# Altium schematic sheet FLASH.SchDoc
size A
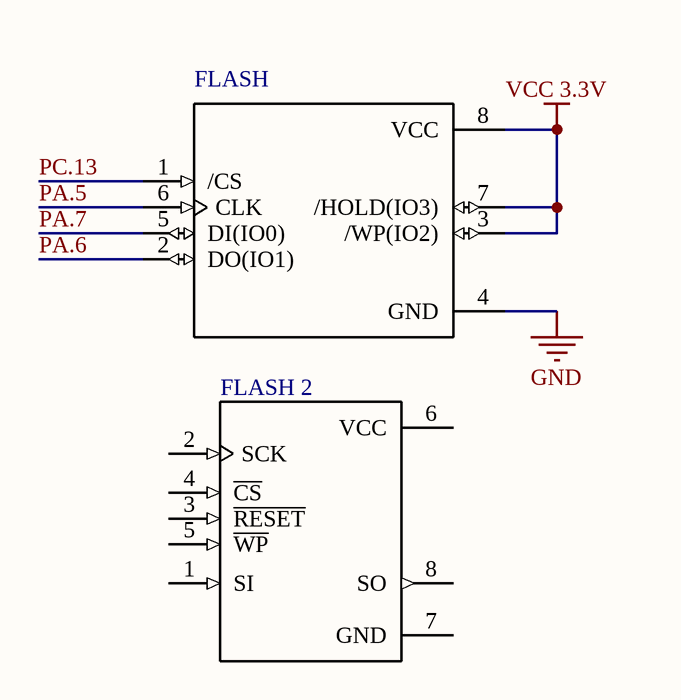
[diagram p0: FLASH.SchDoc]

## Parts
FLASH  W25Q16BVSSIG  [*SOIC127P790X216-8N]  (value not drawn)
FLASH_2  AT45DB041E-SSHNHA-T  [*SOIC127P600X175-8N]  (value not drawn)

## Nets
GND: FLASH.4(GND)
VCC 3.3V: FLASH.3(/WP(IO2)) FLASH.7(/HOLD(IO3)) FLASH.8(VCC)
PA.5: FLASH.6(CLK)
PA.6: FLASH.2(DO(IO1))
PA.7: FLASH.5(DI(IO0))
PC.13: FLASH.1(/CS)

Not connected (* = marked no-connect by the designer): FLASH_2 1(SI) 2(SCK) 3(~{RESET}) 4(~{CS}) 5(~{WP}) 6(VCC) 7(GND) 8(SO)

## Library data of the parts
FLASH = W25Q16BVSSIG: Flash, pin, soic, flash, Memory, Semiconductors and Actives, serial, ic; MF: Winbond; Price: None; Availability: Unavailable; SnapEDA_Link: https://www.snapeda.com/parts/W25Q16BVSSIG/Winbond%20Electronics/view-part/?ref=snap; MP: W25Q16BVSSIG; Package: SOIC-8 Winbond; Value: *
FLASH_2 = AT45DB041E-SSHNHA-T: Memory: Serial Flash; 4Mbit; SPI / RapidS; 85MHz; 1.65Ã·3.6V; SO8; MF: Adesto; Price: None; Availability: Unavailable; SnapEDA_Link: https://www.snapeda.com/parts/AT45DB041E-SSHNHA-T/Adesto%20Technologies/view-part/?ref=snap; MP: AT45DB041E-SSHNHA-T; Package: SOIC-8 Adesto Technologies; Value: *